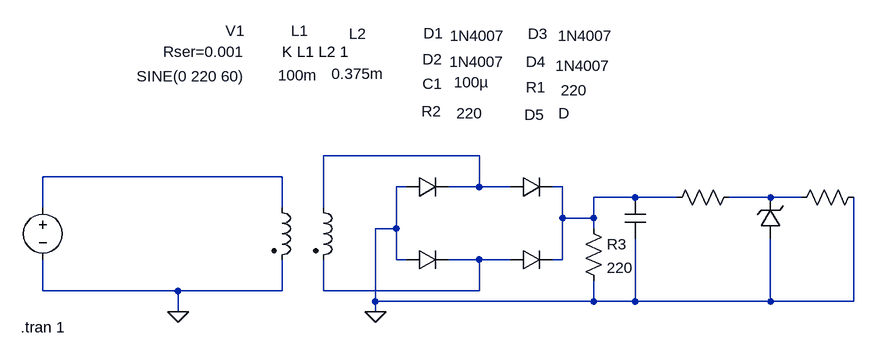
[diagram p0: schematic SIMULASI POWER SUPPLY BERBASIS LTSPICE.asc]
SIMULASI POWER SUPPLY BERBASIS LTSPICE.asc, the LTspice schematic file:
Version 4
SHEET 1 1192 680
WIRE 608 48 368 48
WIRE 304 80 -64 80
WIRE 496 96 480 96
WIRE 608 96 608 48
WIRE 608 96 560 96
WIRE 656 96 608 96
WIRE 736 96 720 96
WIRE 848 112 784 112
WIRE 912 112 848 112
WIRE 1056 112 992 112
WIRE 1104 112 1056 112
WIRE -64 128 -64 80
WIRE 304 128 304 80
WIRE 368 128 368 48
WIRE 736 144 736 96
WIRE 784 144 784 112
WIRE 784 144 736 144
WIRE 480 160 480 96
WIRE 480 160 448 160
WIRE 784 160 784 144
WIRE 480 208 480 160
WIRE 496 208 480 208
WIRE 608 208 560 208
WIRE 656 208 608 208
WIRE 736 208 736 144
WIRE 736 208 720 208
WIRE -64 256 -64 208
WIRE 144 256 -64 256
WIRE 304 256 304 208
WIRE 304 256 144 256
WIRE 368 256 368 208
WIRE 608 256 608 208
WIRE 608 256 368 256
WIRE 448 272 448 160
WIRE 784 272 784 240
WIRE 784 272 448 272
WIRE 848 272 848 176
WIRE 848 272 784 272
WIRE 1056 272 1056 176
WIRE 1056 272 848 272
WIRE 1184 272 1184 112
WIRE 1184 272 1056 272
WIRE 144 288 144 256
WIRE 448 288 448 272
FLAG 144 288 0
FLAG 448 288 0
SYMBOL voltage -64 112 R0
WINDOW 0 281 -256 Left 2
WINDOW 3 144 -186 Left 2
WINDOW 123 0 0 Left 0
WINDOW 39 185 -224 Left 2
SYMATTR InstName V1
SYMATTR Value SINE(0 220 60)
SYMATTR SpiceLine Rser=0.001
SYMBOL ind2 288 112 R0
WINDOW 0 30 -256 Left 2
WINDOW 3 10 -188 Left 2
SYMATTR InstName L1
SYMATTR Value 100m
SYMATTR Type ind
SYMBOL ind2 352 112 R0
WINDOW 0 55 -252 Left 2
WINDOW 3 28 -190 Left 2
SYMATTR InstName L2
SYMATTR Value 0.375m
SYMATTR Type ind
SYMBOL diode 496 112 R270
WINDOW 0 237 41 VTop 2
WINDOW 3 264 109 VBottom 2
SYMATTR InstName D1
SYMATTR Value 1N4007
SYMBOL diode 496 224 R270
WINDOW 0 309 40 VTop 2
WINDOW 3 336 108 VBottom 2
SYMATTR InstName D2
SYMATTR Value 1N4007
SYMBOL diode 656 112 R270
WINDOW 0 236 42 VTop 2
WINDOW 3 264 115 VBottom 2
SYMATTR InstName D3
SYMATTR Value 1N4007
SYMBOL diode 656 224 R270
WINDOW 0 305 39 VTop 2
WINDOW 3 330 111 VBottom 2
SYMATTR InstName D4
SYMATTR Value 1N4007
SYMBOL cap 832 112 R0
WINDOW 0 -312 -175 Left 2
WINDOW 3 -263 -177 Left 2
SYMATTR InstName C1
SYMATTR Value 100µ
SYMATTR SpiceLine V=16
SYMBOL res 1008 96 R90
WINDOW 0 -138 313 VBottom 2
WINDOW 3 -164 254 VTop 2
SYMATTR InstName R1
SYMATTR Value 220
SYMBOL zener 1072 176 R180
WINDOW 0 364 191 Left 2
WINDOW 3 325 193 Left 2
SYMATTR InstName D5
SYMBOL res 1200 96 R90
WINDOW 0 -101 666 VBottom 2
WINDOW 3 -129 607 VTop 2
SYMATTR InstName R2
SYMATTR Value 220
SYMATTR SpiceLine pwr=0.25
SYMBOL res 768 144 R0
SYMATTR InstName R3
SYMATTR Value 220
SYMATTR SpiceLine pwr=0.25
TEXT 304 -112 Left 2 !K L1 L2 1
TEXT -98 312 Left 2 !.tran 1

The netlist it stands for:
* SIMULASI POWER SUPPLY BERBASIS LTSPICE.asc
V1 N002 0 SINE(0 220 60) Rser=0.001
L1 N002 0 100m
L2 N001 N005 0.375m
D1 0 N001 1N4007
D2 0 N005 1N4007
D3 N001 N003 1N4007
D4 N005 N003 1N4007
C1 N003 0 100µ V=16
R1 N004 N003 220
D5 0 N004 D
R2 0 N004 220 pwr=0.25
R3 N003 0 220 pwr=0.25
.model D D
.lib standard.dio
K L1 L2 1
.tran 1
.backanno
.end